# EAGLE design diskohedron4w_hermaphrodit (EAGLE 6.5.0)
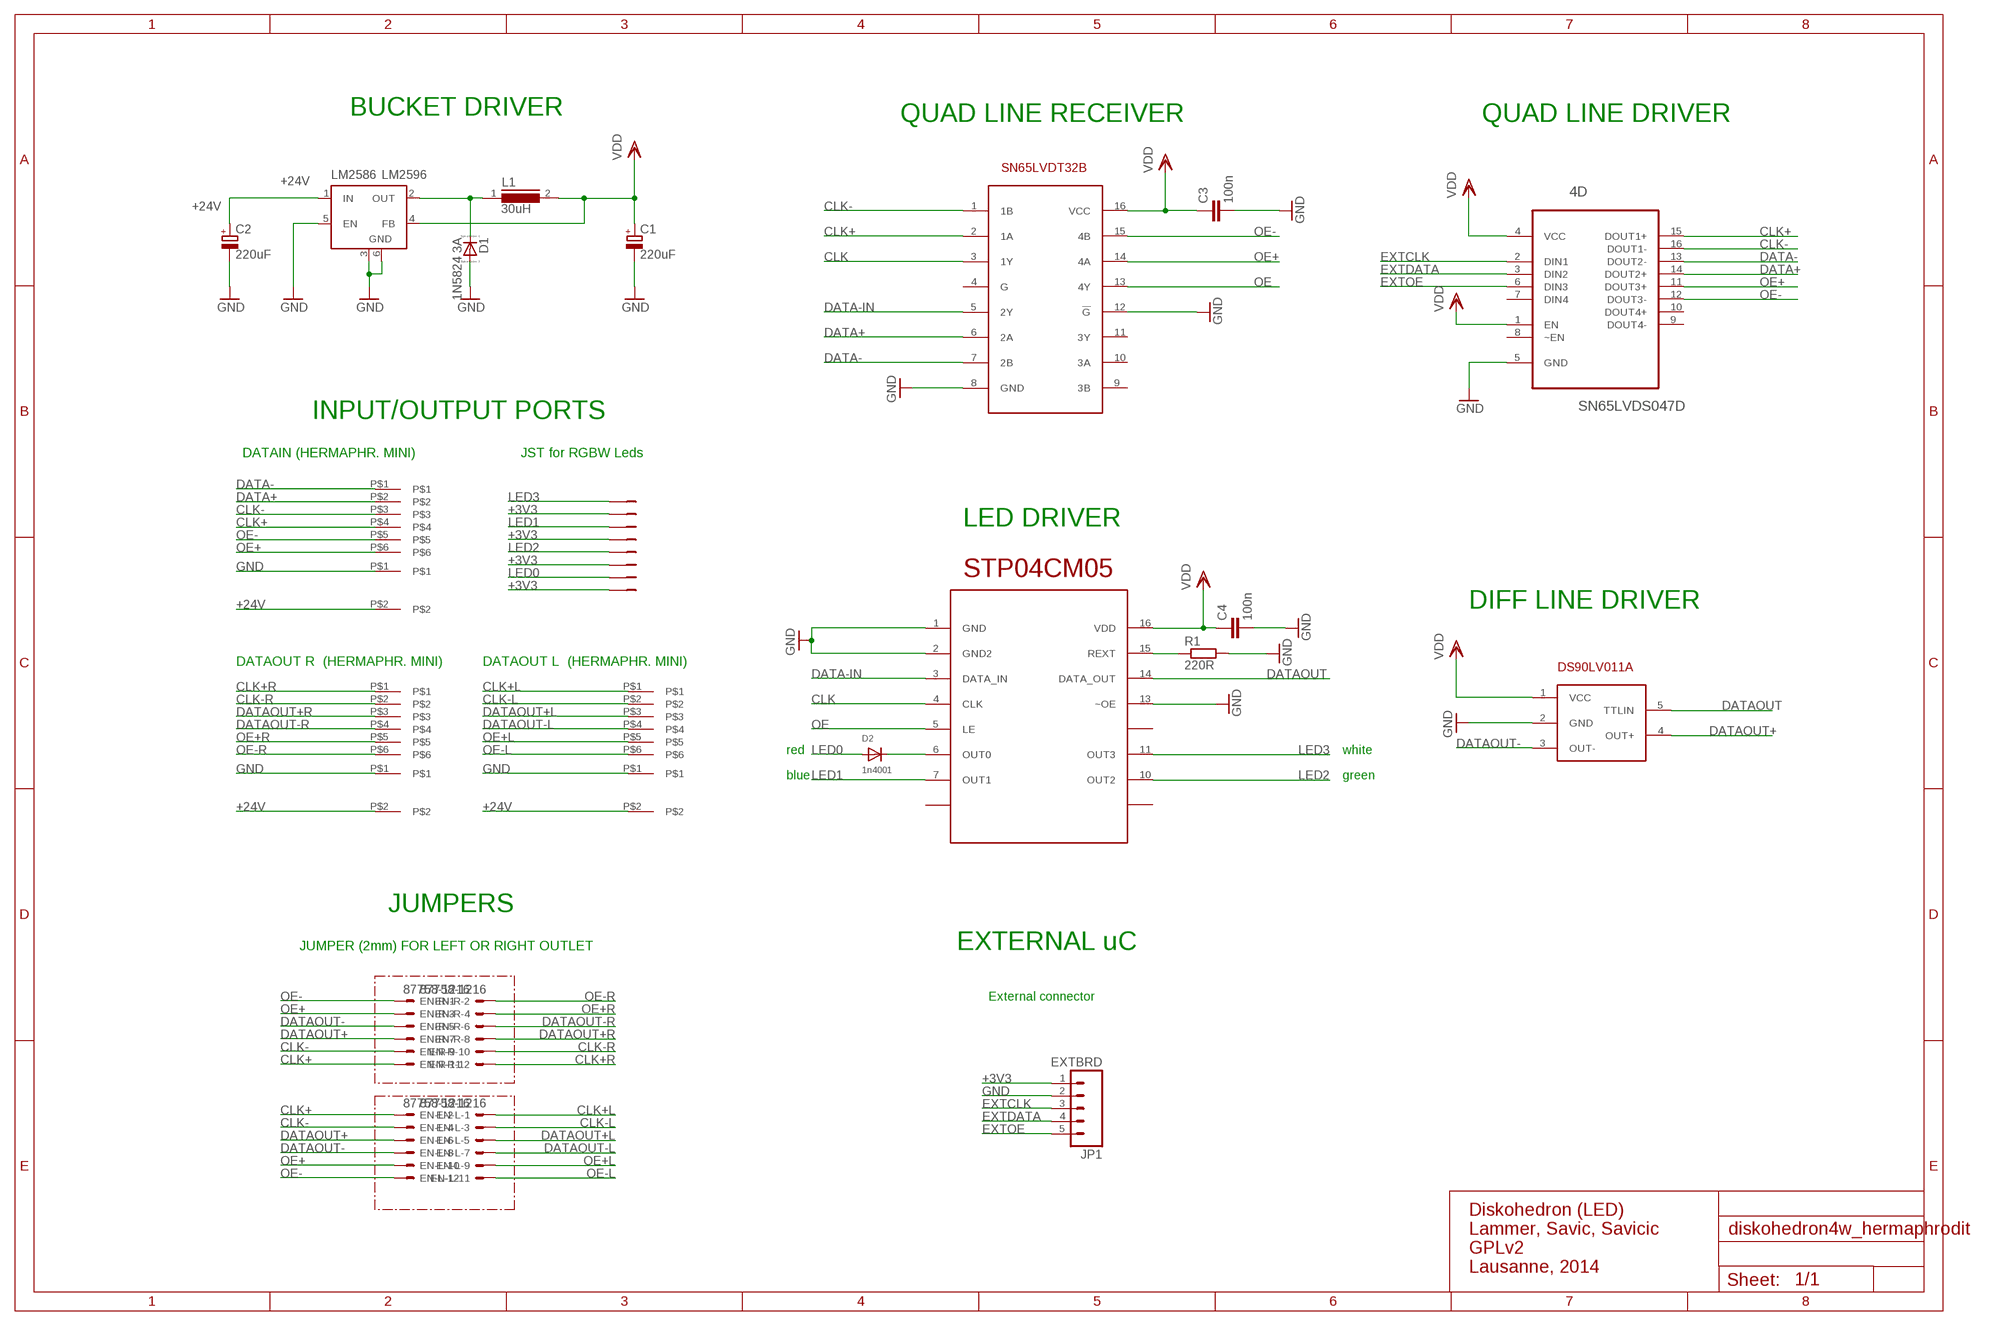
[diagram p0: schematic, sheet 1]

## Parts
1D  DS90LV011A  [SOT23-5]
4D  SN65LVDS047D  [SOIC127P600X175-16N]
4R  SN65LVDST32  [SOIC16]
C1  220uF  CPOL-EU153CLV-1010  [153CLV-1010]
C2  220uF  CPOL-EU153CLV-1010  [153CLV-1010]
C3  100n  C-EUC0805  [C0805]
C4  100n  C-EUC0805  [C0805]
D1  1N5824 3A  DIODE_E-SMC  [DIODE_SMC]
D2  1n4001  DIODESMA  [SMADIODE]
EN-L  87758-1216  [87758-1216]
EN-R  87758-1216  [87758-1216]
IN1  HERMAPHRODITMINI6PIN  [HERMAPHRODITMINI6PIN]
JP1  EXTBRD  M05PTH  [1X05]
JST  8PIN-ZH  [B8B-ZH]
L1  30uH  DR127  [DR127]
LM2586  LM2596  LM2596S  [TO263-5]
OUT-L  HERMAPHRODITMINI6PIN  [HERMAPHRODITMINI6PIN]
OUT-R  HERMAPHRODITMINI6PIN  [HERMAPHRODITMINI6PIN]
R1  220R  R-EU_M0805  [M0805]
STP04  STP04CM05  [TSSOP16]
U$6  HERMAPHRODIT2PIN  [HERMAPHRODIT2PIN]
U$7  HERMAPHRODIT2PIN  [HERMAPHRODIT2PIN]
U$12  HERMAPHRODIT2PIN  [HERMAPHRODIT2PIN]

## Nets
+3V3: 1D.1(VCC) 4D.1(EN) 4D.4(VCC) 4R.16(VCC) C1.+ C3.1 C4.1 JP1.1 JST.2 JST.4 JST.6 JST.8 L1.2 LM2586.4(FB) STP04.16(VDD) ; supply symbol labelled VDD
+24V: C2.+ LM2586.1(IN) U$6.P$2 U$7.P$2 U$12.P$2
CLK: 4R.3(1Y) STP04.4(CLK)
CLK+: 4D.15(DOUT1+) 4R.2(1A) EN-L.2 EN-R.11 IN1.P$4
CLK+L: EN-L.1 OUT-L.P$1
CLK+R: EN-R.12 OUT-R.P$1
CLK-: 4D.16(DOUT1-) 4R.1(1B) EN-L.4 EN-R.9 IN1.P$3
CLK-L: EN-L.3 OUT-L.P$2
CLK-R: EN-R.10 OUT-R.P$2
DATA+: 4D.14(DOUT2+) 4R.6(2A) IN1.P$2
DATA-: 4D.13(DOUT2-) 4R.7(2B) IN1.P$1
DATA-IN: 4R.5(2Y) STP04.3(DATA_IN)
DATAOUT: 1D.5(TTLIN) STP04.14(DATA_OUT)
DATAOUT+: 1D.4(OUT+) EN-L.6 EN-R.7
DATAOUT+L: EN-L.5 OUT-L.P$3
DATAOUT+R: EN-R.8 OUT-R.P$3
DATAOUT-: 1D.3(OUT-) EN-L.8 EN-R.5
DATAOUT-L: EN-L.7 OUT-L.P$4
DATAOUT-R: EN-R.6 OUT-R.P$4
EXTCLK: 4D.2(DIN1) JP1.3
EXTDATA: 4D.3(DIN2) JP1.4
EXTOE: 4D.6(DIN3) JP1.5
GND: 1D.2(GND) 4D.5(GND) 4R.8(GND) 4R.12(!G) C1.- C2.- C3.2 C4.2 D1.A(C) JP1.2 LM2586.3(GND) LM2586.5(EN) LM2586.6(GND) R1.2 STP04.1(GND) STP04.2(GND2) STP04.13(~OE) U$6.P$1 U$7.P$1 U$12.P$1
LED0: D2.A JST.7
LED1: JST.3 STP04.7(OUT1)
LED2: JST.5 STP04.10(OUT2)
LED3: JST.1 STP04.11(OUT3)
N$1: R1.1 STP04.15(REXT)
N$2: D1.C(A) L1.1 LM2586.2(OUT)
N$3: D2.C STP04.6(OUT0)
OE: 4R.13(4Y) STP04.5(LE)
OE+: 4D.11(DOUT3+) 4R.14(4A) EN-L.10 EN-R.3 IN1.P$6
OE+L: EN-L.9 OUT-L.P$5
OE+R: EN-R.4 OUT-R.P$5
OE-: 4D.12(DOUT3-) 4R.15(4B) EN-L.12 EN-R.1 IN1.P$5
OE-L: EN-L.11 OUT-L.P$6
OE-R: EN-R.2 OUT-R.P$6
Unconnected: 4D.7(DIN4) 4D.8(~EN) 4D.9(DOUT4-) 4D.10(DOUT4+) 4R.4(G) 4R.9(3B) 4R.10(3A) 4R.11(3Y) STP04.8(N.C1) STP04.9(NC) STP04.12(NC3)

## Notes on the sheet
- BUCKET DRIVER | QUAD LINE RECEIVER | QUAD LINE DRIVER
- INPUT/OUTPUT PORTS
- DATAIN (HERMAPHR. MINI) | JST for RGBW Leds
- LED DRIVER
- DIFF LINE DRIVER
- DATAOUT R  (HERMAPHR. MINI) | DATAOUT L  (HERMAPHR. MINI)
- red | white
- blue | green
- JUMPERS
- JUMPER (2mm) FOR LEFT OR RIGHT OUTLET | EXTERNAL uC
- External connector
- for Arduino, etc.
- not differentiated
- Diskohedron (LED)
  Lammer, Savic, Savicic
  GPLv2
  Lausanne, 2014

## Library data of the parts
1D = diskohedron:DS90LV011A: 3V LVDS Single High Speed Differential Driver
4D = Texas Instruments_By_element14_Batch_1:SN65LVDS047D: LVDS QUAD DIFFERENTIAL LINE DRIVER; MPN: SN65LVDS047D; OC_FARNELL: 8452350; OC_NEWARK: 75C7839; PACKAGE: SOIC-16; SUPPLIER: TEXAS INSTRUMENTS
4R = diskohedron:SN65LVDST32
C1 C2 = rcl:CPOL-EU: POLARIZED CAPACITOR, European symbol
C3 C4 = rcl:C-EU: CAPACITOR, European symbol
D1 = eagle-ltspice:DIODE_E-: Schottky Diode; SPICEMODEL: diode; SPICEPREFIX: D
D2 = adafruit:DIODE: Diode SMADIODE - SMA Surface Mount Package 20V 1A Schottky Diode Digikey: 641-1014-6-ND DO-1N4148 - Through Hole Small Current Diode SOD-123 20V 1 A (.5mV Vf) Schottky Diode - Digikey: MBRX120TPMSCT-ND SOD-323 10V 570mA (.38mV Vf, 3ns) Schottky Diode - Digikey: ZLLS410CT-ND SOD-523 30V 30mA Schottky Diode (RB751S-40TE61) - Digikey: RB751S-40TE61CT-ND SOT23-R/W - SOT23 Package (R = Solder Paste/Reflow Ovens, W = Hand-Soldering) BAT54Film 40V 300mA - Digikey: 497-7162-1-ND
EN-L EN-R = con-molex:87758-1216: 12 Pin - 2mm Dual Row Single Wafer, Vertical T/H HDR Source: http://www.molex.com/pdm_docs/sd/877580616_sd.pdf; MPN: 87758-1216; OC_FARNELL: unknown; OC_NEWARK: 25M5671
IN1 OUT-L OUT-R = diskohedron:HERMAPHRODITMINI6PIN: MINIATURE HERMAPHRODITIC (6P) 1971567-3 TE Internal Number: 1971567-3 http://www.te.com/catalog/bin/TE.Connect?S=29506&M=PPROP&P=&BML=&LG=1&PG=1&IDS=517146,517147,517148&N=3
JP1 = SparkFun-Connectors:M05: Header 5 Standard 5-pin 0.1" header. Use with straight break away headers (SKU : PRT-00116), right angle break away headers (PRT-00553), swiss pins (PRT-00743), machine pins (PRT-00117), and female headers (PRT-00115). Molex polarized connector foot print use with SKU : PRT-08230 with associated crimp pins and housings.
JST = diskohedron:8PIN-ZH
L1 = inductors:DR127: High Power Density, High Efficiency, Shielded Inductors Source: coiltronics_dr_series.pdf
LM2586 = linear:LM2596S: STEP-DOWN VOLTAGE REGULATOR
R1 = resistor:R-EU_: RESISTOR, European symbol
STP04 = stp04:STP04CM05
U$6 U$7 U$12 = diskohedron:HERMAPHRODIT2PIN: Hermaphroditic Blade and Receptacle Connectors TE Internal Number: 1954289-1 http://www.te.com/catalog/pn/en/1954289-1?RQPN=1954289-1

## Board
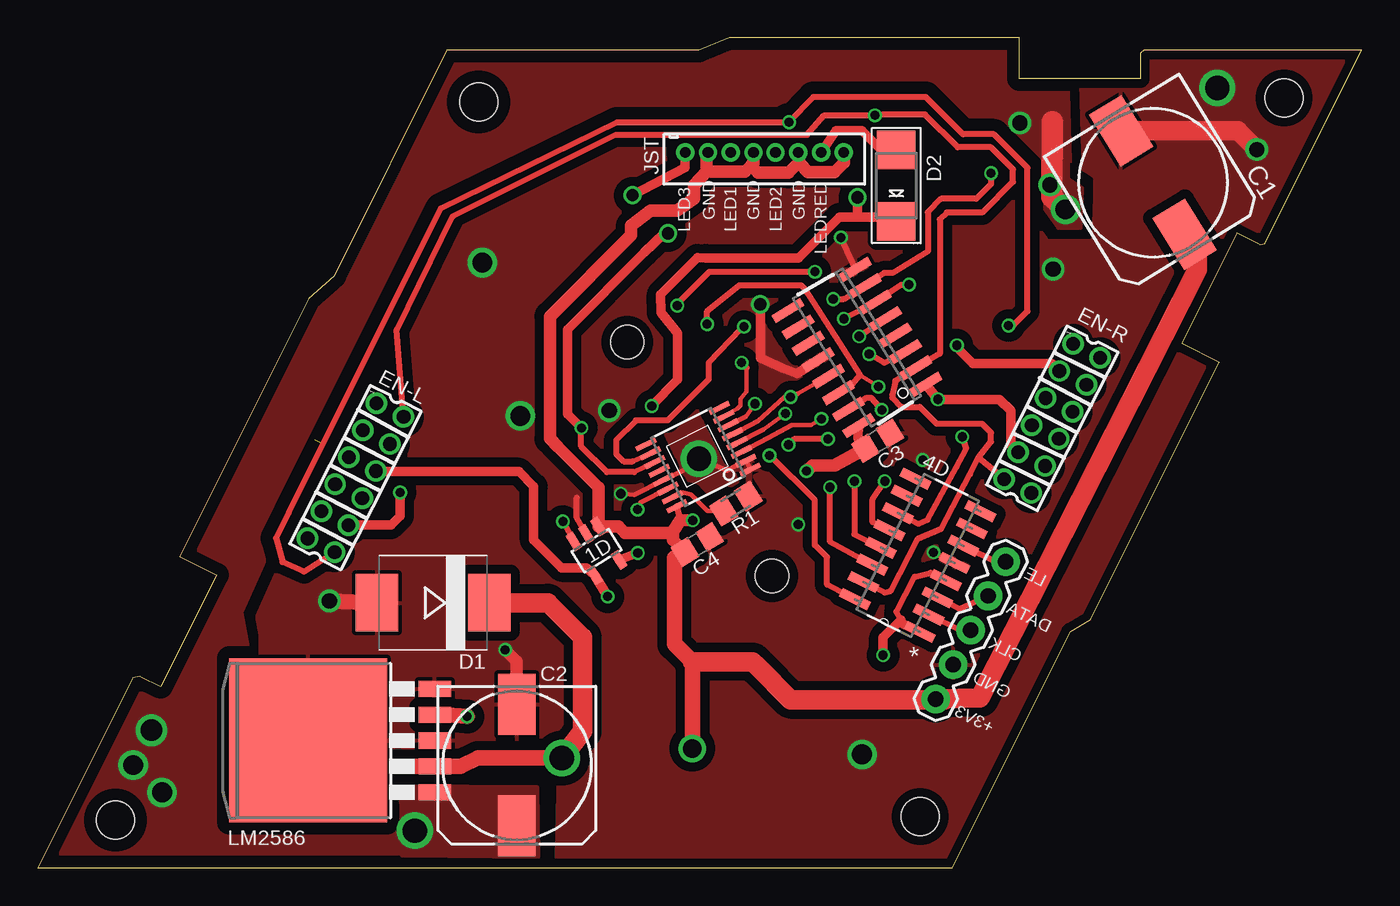
[diagram p1: board, top side]
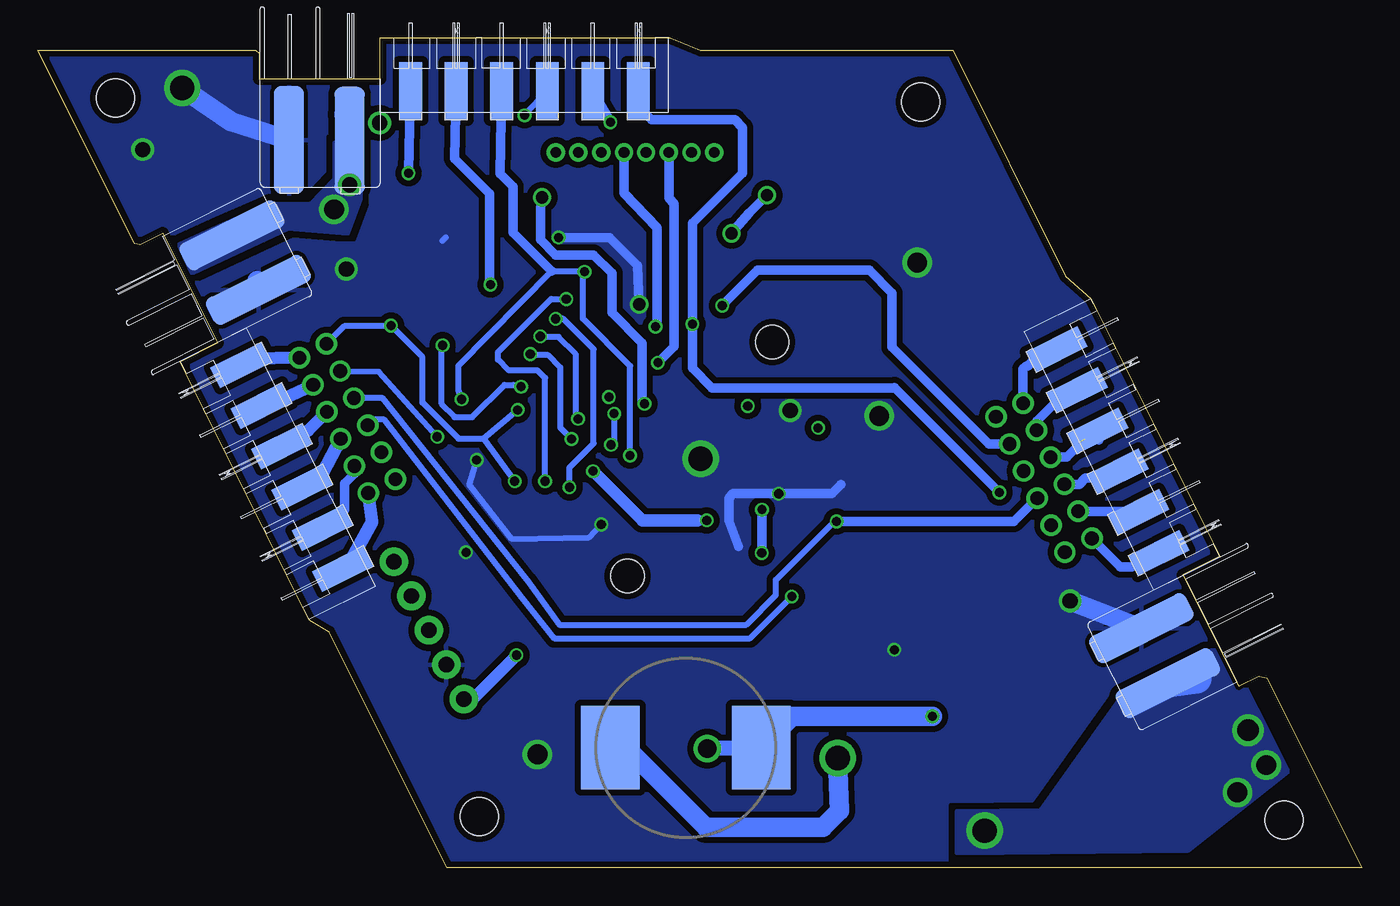
[diagram p2: board, bottom side, seen from below]

Size 87.17 x 54.68 mm. Coordinates in mm from the lower left corner, seen from the top.
Outline: 0,0 60.23,0 68,15.55 69.3,16.35 77.81,33.34 75.32,34.58 78.97,41.83 80.47,41.08 80.8,41.12 87.17,53.88 72.85,53.88 72.6,53.68 72.6,52 64.62,52 64.62,54.68 45.55,54.68 43.55,53.88 26.93,53.88 19.5,39 17.83,37.5 9.34,20.51 11.76,19.3 8.07,11.95 6.72,12.62 6.25,12.53 0,0
Copper layers (1*16): Top 0.035mm / dielectric 1.5mm / Bottom 0.035mm
Design rules "ITEADstudio_DRC": minimum track width 6mil, minimum drill 12mil, track to track 6mil, track to pad 6mil, pad to pad 6mil, via to via 6mil, smd to smd 0mil, copper to edge 10mil, drill to drill 10mil, minimum pad ring 10mil, minimum via ring 6mil, stop-mask expansion 2mil, vias tented up to drill 100mil, thermal gap 10mil
Holes 2.5 mm at 5.1,3.15 82.06,50.73 29.03,50.46 58.11,3.39
Holes 2.2 mm at 38.81,34.64 48.35,19.22
Milling: 25 lines

### Footprints (pad centres in the part's own frame; a part is rotated, then mirrored left to right if it is on the bottom)
SOT23-5 = smd 0.55 x 1.2: 1 -0.95,-1.3; 2 0,-1.3; 3 0.95,-1.3; 4 0.95,1.3; 5 -0.95,1.3
SOIC127P600X175-16N = smd 2.057 x 0.61: 1 -4.801,8.89; 2 -4.801,7.62; 3 -4.801,6.35; 4 -4.801,5.08; 5 -4.801,3.81; 6 -4.801,2.54; 7 -4.801,1.27; 8 -4.801,0; 9 0,0; 10 0,1.27; 11 0,2.54; 12 0,3.81; 13 0,5.08; 14 0,6.35; 15 0,7.62; 16 0,8.89
SOIC16 = smd 0.6 x 2.2: 1 -4.445,-2.6; 2 -3.175,-2.6; 3 -1.905,-2.6; 4 -0.635,-2.6; 5 0.635,-2.6; 6 1.905,-2.6; 7 3.175,-2.6; 8 4.445,-2.6; 9 4.445,2.6; 10 3.175,2.6; 11 1.905,2.6; 12 0.635,2.6; 13 -0.635,2.6; 14 -1.905,2.6; 15 -3.175,2.6; 16 -4.445,2.6
153CLV-1010 = smd 4 x 2.5: + 4,0; - -4,0
C0805 = smd 1.3 x 1.5: 1 -0.95,0; 2 0.95,0
DIODE_SMC = smd 2.8 x 3.8: A 3.7,0; C -3.7,0
SMADIODE = smd 2.54 x 2.54: A 2.349,0; C -2.349,0
87758-1216 = drill 0.9 pad 1.27: 1 -5,-1; 2 -5,1; 3 -3,-1; 4 -3,1; 5 -1,-1; 6 -1,1; 7 1,-1; 8 1,1; 9 3,-1; 10 3,1; 11 5,-1; 12 5,1
HERMAPHRODITMINI6PIN = smd 1.5 x 3.8: P$1 1.996,1.406; P$2 4.997,1.406; P$3 7.997,1.406; P$4 10.997,1.406; P$5 13.997,1.406; P$6 16.997,1.406
1X05 = drill 1.016 pad 1.88: 1 0,0; 2 2.54,0; 3 5.08,0; 4 7.62,0; 5 10.16,0
B8B-ZH = drill 0.7 pad 1.1: 1 -2.25,0; 2 -0.75,0; 3 0.75,0; 4 2.25,0; 5 3.7,0; 6 5.2,0; 7 6.7,0; 8 8.2,0
DR127 = smd 3.85 x 5.5: 1 -4.975,0; 2 4.975,0
TO263-5 = smd 1.067 x 2.159: 1 -3.404,-5.791; 2 -1.702,-5.791; 3 0,-5.791; 4 1.702,-5.791; 5 3.404,-5.791 | smd 10.8 x 10.41: 6 0,2.54
M0805 = smd 1.3 x 1.6: 1 -0.95,0; 2 0.95,0
TSSOP16 = smd 0.35 x 1.43: 1 -2.275,-2.7; 2 -1.625,-2.7; 3 -0.975,-2.7; 4 -0.325,-2.7; 5 0.325,-2.7; 6 0.975,-2.7; 7 1.625,-2.7; 8 2.275,-2.7; 9 2.275,2.7; 10 1.625,2.7; 11 0.975,2.7; 12 0.325,2.7; 13 -0.325,2.7; 14 -0.975,2.7; 15 -1.625,2.7; 16 -2.275,2.7
HERMAPHRODIT2PIN = smd 2 x 7.1: P$1 1.9,3.5; P$2 5.9,3.45

### Placement (x,y rotation side)
1D  36.79,20.89 211.5 top
4D  57.79,25.65 153.4 top
4R  53.94,34.29 121.5 top
C1  73.43,45.15 301.5 top
C2  31.54,6.77 270 top
C3  55.3,28.14 31.5 top
C4  43.43,21.32 31.5 top
D1  26.03,17.47 180 top
D2  56.53,44.95 90 top
EN-L  20.92,25.71 243 top
EN-R  66.8,29.61 243 top
IN1  64.63,49.78 0 bottom
JP1  59.13,11.13 63 top
JST  44.88,47.13 0 top
L1  44.52,7.92 0 bottom
LM2586  20.35,8.39 90 top
OUT-L  22.23,35.32 296.6 bottom
OUT-R  64.93,18.56 116.6 bottom
R1  45.96,24 31.5 top
STP04  43.48,27.07 116.6 top
U$6  68.67,37.94 116.6 bottom
U$7  72.54,44.45 0 bottom
U$12  18.49,15.92 296.6 bottom

### Tracks (layer width: path | path; a pad name or v marks a point on that pad's centre or on a via)
+3V3  (via drill 0.6, 1.2)
  Top 0.406: 42.3,22.91 STP04.16 | C3.1 53.99,28.3 | 41.77,22.08 41.83,22.16 | 56.98,16.08 56.83,16.34 56.53,16.88 57.73,19.18 58.8,19.45 4D.4
  Top 0.61: 44.02,45.88 44.02,46.2 44.35,45.88 | 44.02,47.28 JST.2 | 50.23,46.35 50.23,47.23 JST.6 50.08,46.45 | 47.13,46.43 46.96,46.26 | 53.99,28.3 4R.16 | 4D.1 56.98,16.08 | 34.23,27.78 34.23,27.75 | v55.66,14.01 55.66,15.17 56.83,16.34
  Top 0.813: v43.13,22.9 42.3,22.91 41.83,22.16 41.83,21.61 C4.1 | v50.62,26.14 51.02,26.53 52.47,26.53 C3.1 | 34.23,27.75 36.92,25.06 1D.1 38.25,22.5 38.68,22.08 41.77,22.08 | 44.02,45.88 43.23,44.98 43.23,44.1 42.08,43.3 40.35,43.3 39.07,42.3 39.08,41.68 33.73,36.33 33.73,28.28 34.23,27.78 | 44.02,46.2 44.02,47.28 | JST.8 53.08,46.45 52.48,45.85 50.73,45.85 50.23,46.35 | JST.4 47.13,46.43 | 44.35,45.88 46.58,45.88 46.96,46.26 47.43,45.8 49.43,45.8 50.08,46.45
  Top 1.016: v43.1,7.87 43.11,13.58 41.92,14.76 41.92,20.41 C4.1 | 75.99,41.2 C1.+ | LM2586.4 26.93,10.09 v28.27,9.98
  Top 1.27: 43.11,13.58 47.08,13.58 47.38,13.28 49.58,11.07 59.72,11.07 JP1.1 62.05,11.2 76.35,39.43 76.35,40.84 75.99,41.2
  Bottom 0.61: 43.75,22.88 v43.13,22.9 | JP1.1 58.52,11.13
  Bottom 0.813: 43.75,22.88 47.36,22.88 v50.62,26.14 | 58.52,11.13 v55.66,14.01
  Bottom 1.016: v43.1,7.87 L1.2
  Bottom 1.27: 38.63,7.92 L1.2 37.48,9.98 v28.27,9.98
+24V  (via drill 1, 1.3 pad 1.68, 1.4 pad 1.68, 1.6)
  Top 1.422: 66.82,49.16 66.77,44.18 v67.67,43.38
  Bottom 1.676: U$7.P$2 66.82,49.68 | U$12.P$2 12.19,12.46
  Bottom 1.93: U$12.P$2 10.86,12.46
  other vias: 64.67,49.08 24.83,2.45 7.47,9.07 6.27,6.77 8.17,4.97 66.65,45
  pour Top (isolate 0.813): 67.77,53.38 67.97,46.52 65.52,46.68 38.18,49.98 25.38,43.58 13.4,16.83 13.97,13.65 13.1,3.5 29.58,3.38 29.18,-0.23 0.08,-0.43 6.47,12.38 7.07,12.57 10.78,19.98 8.67,21.08 16.88,37.88 19.98,38.88 27.08,53.58 43.88,53.58 45.77,55.58 64.47,55.58 64.47,53.38
  pour Top (no thermals): 23.93,5.38 32.88,5.3 32.93,0.75 23.98,0.82
  pour Bottom (rank 2, no thermals): 9.07,14.67 4.88,6.38 11.47,1.18 26.6,1 26.6,3.7 21.08,3.77 15.55,11.53
  pour Bottom (no thermals): 67.62,47.77 67.62,45.38 69.22,43.74 71.77,43.76 74.97,42.38 77.88,41.08 77.02,39.18 70.74,42.11 66.77,41.77 65.92,44.08 65.88,47.93
  pour Top (isolate 0.813): 66.32,50.88 66.32,43.38 67.17,42.18 68.67,42.18 68.77,44.77 67.88,45.38 67.88,50.98
CLK  (via drill 0.6)
  Top 0.305: STP04.4 47.8,28.88 v49.23,29.93
  Top 0.406: 4R.3 55.75,33.27 v54.75,33.85 | v52.02,28.25 49.8,28.25 v49.43,27.88
  Bottom 0.406: v52.02,28.25 52.77,29 52.77,32.98 53.58,33.77 54.68,33.77 v54.75,33.85 | v49.23,29.93 49.23,28.08 v49.43,27.88
CLK+  (via drill 0.6)
  Top 0.305: 58.58,33.38 58.25,33.38 4R.2
  Top 0.406: EN-L.2 23.63,35.45 23.65,35.48 27.33,42.93 38.05,48.3 50.65,48.3 51.77,49.58 v55.12,49.58 55.62,49.62 58.43,49.62 60.58,47.48 62.77,47.48 64.22,46.02 64.22,45.2 62.2,43.18 59.85,43.18 59.4,42.73 59.4,33.88 58.58,33.38 | 4R.2 56.48,32.08 56.27,31.18 56.27,30.98 56.88,30.38 58.08,30.38 59.18,29.28 62.18,29.28 62.77,28.68 62.77,28.08 61.95,27.03 | 4D.15 55.77,18.14 56.17,18.26 57.97,21.7 59.49,22.35 61.38,25.94 61.95,27.03 | EN-R.11 62.14,26.86 61.95,27.03
  Bottom 0.406: IN1.P$4 v55.12,49.58
CLK+L
  Bottom 0.406: OUT-L.P$1 19.52,34.63
  Bottom 0.61: 19.52,34.63 21.48,33.58 21.98,33.08 22.08,33.08 22.3,32.85 EN-L.1
CLK+R
  Bottom 0.305: 67.27,19.68 OUT-R.P$1
  Bottom 0.406: 66.72,19.99 67.27,19.68
  Bottom 0.813: 66.72,19.99 65.17,22.8 EN-R.12
CLK-  (via drill 0.6, 0.6 pad 0.81)
  Top 0.406: 51.12,39.33 v51.18,39.27 v51.17,39.28 44.22,39.28 42.11,37.16 v42.11,37.05 | 4D.16 51.98,18.68 51.98,20.48 51.18,21.28 51.18,24.23 48.23,27.18 v48.18,27.18
  Top 0.61: 4R.1 v59.27,30.87 63.33,30.87 64.07,30.12 64.07,27.86 EN-R.9
  Bottom 0.406: v59.27,30.87 59.5,31.5 59.5,33.08 53.35,39.33 53.3,39.27 v51.18,39.27 51.27,39.18 51.27,36.18 48.18,33.08 v48.18,27.18
  Bottom 0.61: 53.35,39.33 55.88,41.85 55.88,44.88 56.74,45.74 IN1.P$3 | EN-L.4 24.53,27.93 30.93,34.33 30.93,37.88 32.43,39.38 39.78,39.38 v42.11,37.05
CLK-L
  Bottom 0.406: OUT-L.P$2 18,31.95
  Bottom 0.61: EN-L.3 21.39,29.44 20.08,30.75 19.41,30.75 OUT-L.P$2
CLK-R
  Bottom 0.61: EN-R.10 66.33,25.97 66.97,25.33 66.97,23.58 67.72,22.83 68.11,22.83 OUT-R.P$2
  Bottom 0.813: 68.27,22.68 OUT-R.P$2
DATA+  (via drill 0.6)
  Top 0.305: 4R.6 55.45,37.27
  Top 0.406: v57.38,38.43 56.9,38.43 4R.6 v53.08,36.18 | 4D.14 52.18,21.48 v52.18,25.08
  Bottom 0.305: 57.43,38.48 v57.38,38.43
  Bottom 0.406: v52.18,25.08 52.18,26.38 50.58,27.98 50.58,34.18 52.58,36.18 v53.08,36.18
  Bottom 0.61: IN1.P$2 59.73,46.73 57.43,44.43 57.43,38.48
DATA-  (via drill 0.6)
  Top 0.406: v62.77,45.77 62.77,45.05 61.8,44.08 59.48,44.08 58.6,43.2 58.6,40.6 56.3,39.2 55.75,39.2 4R.7 53.08,37.48 v52.38,37.48 | v53.77,25.48 53.77,21.98 4D.13
  Bottom 0.406: v53.77,25.48 53.77,32.27 54.27,32.77 56.18,32.77 56.88,33.48 56.88,33.98 53.38,37.48 v52.38,37.48
  Bottom 0.61: IN1.P$1 62.74,47.46 v62.77,45.77
DATA-IN  (via drill 0.6)
  Top 0.305: STP04.3 48.08,28.32 49.68,29.18 50.9,29.18 v51.61,29.58
  Top 0.406: v54.09,35.02 4R.5
  Bottom 0.406: v51.61,29.58 51.77,29.61 51.77,33.88 52.88,34.98 54.05,34.98 v54.09,35.02
DATAOUT  (via drill 0.6)
  Top 0.305: STP04.14 39.68,24.08 v39.49,23.6
  Top 0.61: 1D.5 v39.51,20.75
  Bottom 0.61: v39.49,23.6 39.49,20.76 v39.51,20.75
DATAOUT+  (via drill 0.6)
  Top 0.61: v37.52,17.88 1D.4 36.12,19.78 34.48,19.78 32.65,21.6 32.65,25.12 31.68,26.1 22.31,26.1 EN-L.6
  Bottom 0.406: EN-R.7 65.1,29.53 64.38,29.53 55.33,17.83 53.18,15.12 40.27,15.12 v37.52,17.88 37.58,17.83
DATAOUT+L  (1 unrouted)
  Bottom 0.61: 18.62,28.03 17.38,28.68 17.31,28.18 OUT-L.P$3 | EN-L.5 19.41,27.05 18.23,28.23
DATAOUT+R
  Bottom 0.813: OUT-R.P$3 69.38,25.62 68.42,26.03 EN-R.8
DATAOUT-  (via drill 0.6)
  Top 0.406: v34.58,22.83 1D.3
  Bottom 0.406: v34.58,22.83 34.73,22.83 38.58,18.98 38.58,17.98 40.52,16.03 52.83,16.03 54.98,18.98 64.47,30.95 EN-R.5
  Bottom 0.61: v34.58,22.83 22.9,22.83 EN-L.8
DATAOUT-L
  Bottom 0.61: OUT-L.P$4 16.68,25.68 18.18,25.68 18.58,25.27 EN-L.7
DATAOUT-R
  Bottom 0.305: 71.32,27.88 OUT-R.P$4
  Bottom 0.813: 71.32,27.88 69.38,28.82 EN-R.6
EXTCLK
  Top 0.406: JP1.3 60.83,15.62 4D.2
EXTDATA
  Top 0.406: JP1.4 60.68,17.08 4D.3
EXTOE
  Top 0.406: JP1.5 63.27,20.08 4D.6
GND  (via drill 0.6, 0.6 pad 0.81, 0.8, 1, 1 pad 0.81, 1.3 pad 0.81, 1.6)
  Top 0.305: STP04.1 STP04.2 45.38,26.18 v43.53,26.96 42.48,26.18 STP04.13 39.27,24.58 v38.39,24.65
  Top 0.406: v52.88,41.53 4R.8 | C1.- 71.68,49.66 | 4D.5 v58.99,20.79 | 1D.2 35.48,23.08 35.48,24.38
  Top 0.61: 4R.12 49.98,32.58 49.02,32.93 47.58,33.58 v47.58,37.12
  Top 0.813: 14.53,7.54 14.49,7.5 | 14.49,7.5 | 14.49,7.5 14.55,7.44 14.55,7.5 14.49,7.56 | D1.A 21.25,17.12 22.28,16.15 | C2.- 31.53,13.62 v30.78,14.38
  Top 1.016: D1.A v19.19,17.59
  Top 1.27: v80.27,47.33 79.04,48.56 C1.- | 14.53,7.54 14.56,7.54 LM2586.6
  Bottom 0.406: 60.32,41.53 60.56,41.3 | v52.88,41.52 v52.88,41.53 | v58.27,26.88 58.77,25.28 55.98,21.68 50.88,21.78 v50.08,22.62
  Bottom 0.61: v52.88,41.52 49.52,41.52 47.68,39.68 v47.58,37.12 | 41.04,21.18 41.68,22.85 41.68,24.38 41.4,24.65 v38.39,24.65 34.9,24.65 34.27,25.28
  Bottom 1.27: U$12.P$1 v19.19,17.59 | U$6.P$1 72.75,38.7 | U$7.P$1 74.46,49.16 v77.67,51.38
  other vias: 66.86,39.44 29.28,39.88 54.27,7.47 31.78,29.78 37.62,30.12
  pour Top (isolate 0.61, rank 3): 34.12,-0.8 60.18,-1.02 68.47,14.88 72.07,15.78 80.47,32.48 78.77,34.18 81.77,40.58 84.38,44.68 88.88,54.68 72.77,54.48 71.57,54.98 68.27,55.08 68.38,45.38 65.07,50.27 39.77,49.58 26.48,42.88 15.88,22.08 13.97,16.75 14.88,10.67 19.18,6.38 26.28,6.47 34.27,6.47
  pour Bottom (isolate 0.406, rank 3): -0.43,-0.53 89.38,-0.53 89.38,56.58 -0.43,56.58
LED0
  Top 0.406: D2.A 55.55,47.3
  Top 0.61: 55.55,47.3 54.27,48.58 52.57,48.58 JST.7
LED1  (via drill 0.6)
  Top 0.305: 46.68,32.93 46.68,32.08 46.68,31.38 46.27,30.88 46.27,30.48 46.08,30.28 STP04.7
  Top 0.406: v46.35,33.28 46.68,32.93
  Bottom 0.61: v46.35,33.28 45.27,34.35 45.27,43.77 45.63,44.13 JST.3
LED2  (via drill 0.6)
  Top 0.305: 39.18,26.78 STP04.10
  Top 0.406: v46.5,35.65 46.3,35.5 44.18,33.27 44.18,32.18 41.48,29.48 39.38,29.48 38.08,28.18 38.08,27.28 38.58,26.78 39.18,26.78
  Bottom 0.61: JST.5 48.58,44.45 46.4,42.18 46.4,35.76 v46.5,35.65
LED3  (via drill 0.6, 0.8 pad 0.81)
  Top 0.305: 39.27,26.08 STP04.11
  Top 0.406: 39.27,26.08 37.48,26.08 35.77,27.78 35.77,28.97 v35.79,28.99
  Top 0.61: JST.1 42.63,46.13 v39.16,44.31 | v35.79,28.99 34.88,29.91 34.88,35.48 39.93,40.52 41.22,41.79 v41.49,41.8
  Bottom 0.61: v41.49,41.8 40.33,43.18 v39.16,44.31
N$1
  Top 0.305: R1.1 44.11,23.51 43.02,24.61 42.5,24.72 STP04.15
N$2  (via drill 1.6)
  Top 1.016: v34.5,7.24 28.99,7.24 27.85,6.7 23.75,6.7 LM2586.2
  Top 1.27: v34.5,7.24 35.88,9.01 35.88,15.17 33.59,17.46 D1.C
  Bottom 1.27: L1.1 48.42,7.92 43.18,2.68 35.48,2.68 34.4,3.75 v34.5,7.24
N$3  (via drill 0.6, 0.8 pad 0.81)
  Top 0.305: STP04.6 46.62,29.73 v47.23,30.58
  Top 0.61: 53.98,42.88 52.77,42.88 50.08,40.18 43.98,40.18 43.97,40.17 43.43,40.19 41.01,37.77 41.03,36.58 42.13,35.24 42.13,32.18 v40.43,30.43 | 53.98,42.88 56.26,42.88 D2.C | v53.98,44.18 53.98,42.88
  Bottom 0.61: v53.98,44.18 54.08,43.48 54.08,41.38 53.08,40.38 50.58,40.38 49.38,39.18 49.38,36.58 47.38,34.58 47.38,30.73 v47.23,30.58
OE  (via drill 0.6)
  Top 0.305: STP04.5 47.43,29.43 49.18,31.03 v49.58,31.03 50.05,31.24 4R.13
OE+  (via drill 0.6)
  Top 0.305: 53.58,31.83 4R.14 | v55.35,31.7 54.14,32.47
  Top 0.406: v44.08,35.83 44.08,36.68 46.18,38.38 50.27,38.38 50.48,38.18 54.14,32.47 53.58,31.83 | 4D.11 57.98,22.68 58.6,22.93 60.5,26.43 61.15,27.64 v60.88,28.4
  Top 0.61: v60.52,34.43 60.52,34.27 61.58,33.23 66.78,33.23 EN-R.3 | EN-L.10 23.26,22.58 23.85,23.18 v23.85,24.73
  Bottom 0.406: v55.35,31.7 55.88,31.83 56.45,31.83 58.58,29.7 59.75,29.7 59.75,29.75 60.58,30.58 60.58,34.38 v60.52,34.43 | v60.88,28.4 64.72,32.68 67.24,32.7 EN-R.3
  Bottom 0.61: IN1.P$6 47.74,50.24 46.77,49.27 41.27,49.27 40.77,48.77 40.77,45.77 44.08,42.48 v44.08,35.83 44.08,32.93 42.77,31.62 30.8,31.62 30.78,31.65 v23.85,24.73
OE+L
  Bottom 0.61: EN-L.9 14.87,23.49 OUT-L.P$5
OE+R
  Bottom 0.406: OUT-R.P$5 73.01,29.97
  Bottom 0.813: 73.01,29.97 EN-R.4
OE-  (via drill 0.6, 0.6 pad 0.81)
  Top 0.406: 4R.15 53.67,30.33 54.58,30.98 54.88,30.98 v55.58,30.18 | 4D.12 54.98,22.78 54.98,24.28 v55.77,25.48 | v63.93,35.73 64.22,35.73 65.17,36.68 65.17,46.12 62.98,48.33 60.93,48.33 58.48,50.77 51.08,50.77 v49.48,49.12 38.12,49.12 26.55,43.45 16.53,23.4 15.67,21.73 16.1,20.15 17.53,19.53 EN-L.12
  Bottom 0.406: 63.97,35.77 v63.93,35.73 63.89,35.69 | 63.89,35.69 61.85,33.65 61.85,30.65 59.48,28.28 57.81,28.28 | 63.89,35.69 67,35.69 EN-R.1 | 57.81,28.28 v55.77,25.48 | 57.81,28.28 v55.58,30.18
  Bottom 0.61: IN1.P$5 v49.48,49.12
OE-L
  Bottom 0.61: OUT-L.P$6 15.12,19.83 15.87,19.83 EN-L.11
OE-R
  Bottom 0.61: OUT-R.P$6 73.12,33.55
  Bottom 0.813: 73.12,33.55 EN-R.2

### Text on the board
tNames: GND | GND | GND | LED3 | LED1 | LED2 | LEDRED | LE | DATA | CLK | GND | +3V3
bSilk: INPUT | +24V | OUTPUT-L | +24V | DISKO / HEDRON | SAVIC / LAMMER / SAVICIC | OUTPUT-R | +24V | rev.A | 05/2014
geo-helper: rotation angles: / 63.4 / 26.6